# EAGLE design PMT_foot (EAGLE 5.11)
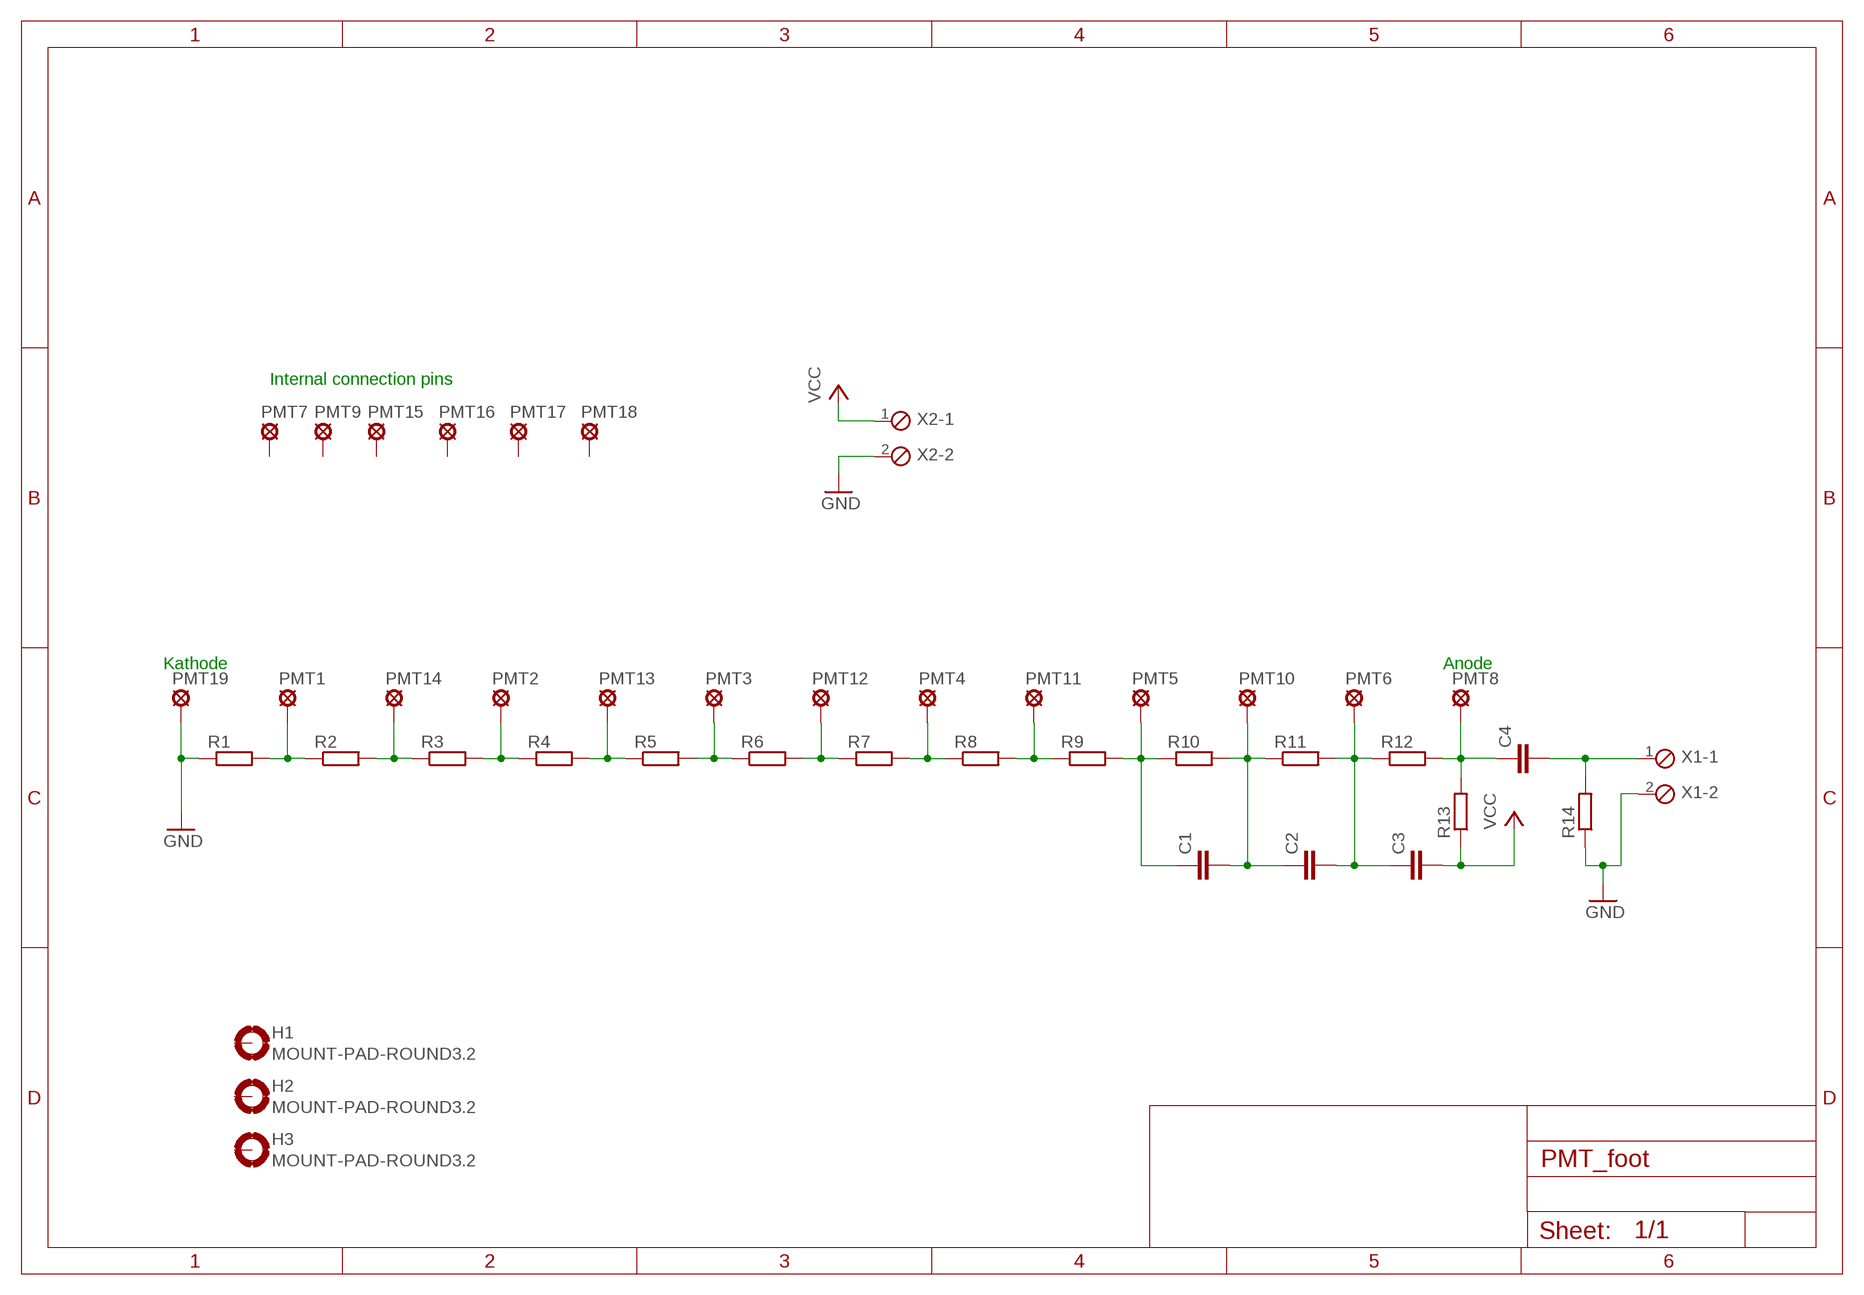
[diagram p0: schematic, sheet 1]

## Parts
C1  C15/7  [C15B7]
C2  C15/7  [C15B7]
C3  C15/7  [C15B7]
C4  C5/2.5  [C5B2.5]
H1  MOUNT-PAD-ROUND3.2  [3,2-PAD]
H2  MOUNT-PAD-ROUND3.2  [3,2-PAD]
H3  MOUNT-PAD-ROUND3.2  [3,2-PAD]
PMT1  SE14  [SE14]
PMT2  SE14  [SE14]
PMT3  SE14  [SE14]
PMT4  SE14  [SE14]
PMT5  SE14  [SE14]
PMT6  SE14  [SE14]
PMT7  SE14  [SE14]
PMT8  SE14  [SE14]
PMT9  SE14  [SE14]
PMT10  SE14  [SE14]
PMT11  SE14  [SE14]
PMT12  SE14  [SE14]
PMT13  SE14  [SE14]
PMT14  SE14  [SE14]
PMT15  SE14  [SE14]
PMT16  SE14  [SE14]
PMT17  SE14  [SE14]
PMT18  SE14  [SE14]
PMT19  SE14  [SE14]
R1  R-EU_0207/2V  [0207/2V]
R2  R-EU_0207/2V  [0207/2V]
R3  R-EU_0207/2V  [0207/2V]
R4  R-EU_0207/2V  [0207/2V]
R5  R-EU_0207/2V  [0207/2V]
R6  R-EU_0207/2V  [0207/2V]
R7  R-EU_0207/2V  [0207/2V]
R8  R-EU_0207/2V  [0207/2V]
R9  R-EU_0207/2V  [0207/2V]
R10  R-EU_0207/2V  [0207/2V]
R11  R-EU_0207/2V  [0207/2V]
R12  R-EU_0207/2V  [0207/2V]
R13  R-EU_0207/2V  [0207/2V]
R14  R-EU_0207/2V  [0207/2V]
X1  MPT2  [2POL254]
X2  MPT2  [2POL254]

## Nets
GND: PMT19.MP R1.1 R14.1 X1.2 X2.2
N$2: PMT1.MP R1.2 R2.1
N$3: PMT14.MP R2.2 R3.1
N$4: PMT2.MP R3.2 R4.1
N$5: PMT13.MP R4.2 R5.1
N$6: PMT3.MP R5.2 R6.1
N$7: PMT12.MP R6.2 R7.1
N$8: PMT4.MP R7.2 R8.1
N$9: PMT11.MP R8.2 R9.1
N$10: C1.1 PMT5.MP R9.2 R10.1
N$11: C1.2 C2.1 PMT10.MP R10.2 R11.1
N$12: C2.2 C3.1 PMT6.MP R11.2 R12.1
N$13: C4.1 PMT8.MP R12.2 R13.2
N$17: C4.2 R14.2 X1.1
VCC: C3.2 R13.1 X2.1
Unconnected: H1.B3,2(MOUNT) H2.B3,2(MOUNT) H3.B3,2(MOUNT) PMT7.MP PMT9.MP PMT15.MP PMT16.MP PMT17.MP PMT18.MP

## Notes on the sheet
- Internal connection pins
- Kathode | Anode

## Library data of the parts
C1-C4 = capacitor-wima:C: CAPACITOR naming: grid - package width
H1-H3 = holes:MOUNT-PAD-ROUND: MOUNTING PAD, round
PMT1-PMT19 = solpad:SE14: SOLDER PAD E1553, drill 1,4mm, distributor Buerklin, 07F820
R1-R14 = rcl:R-EU_: RESISTOR, European symbol
X1 X2 = con-phoenix-254:MPT2: PHOENIX CONNECTOR; OC_FARNELL: unknown; OC_NEWARK: unknown

## Board
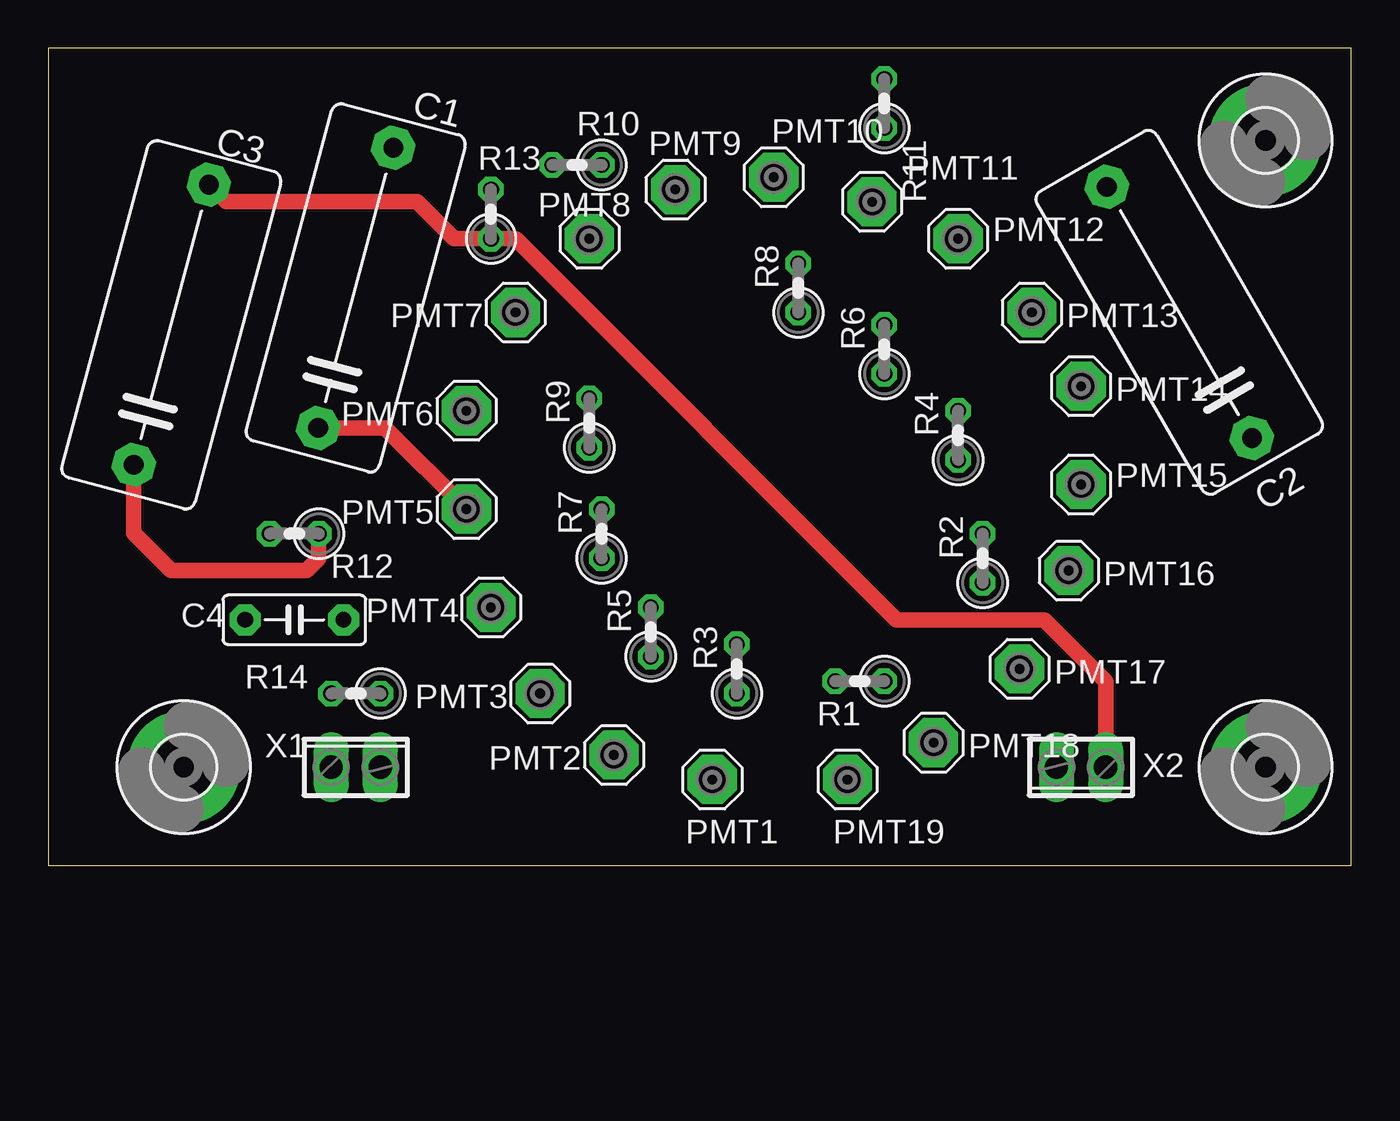
[diagram p1: board, top side]
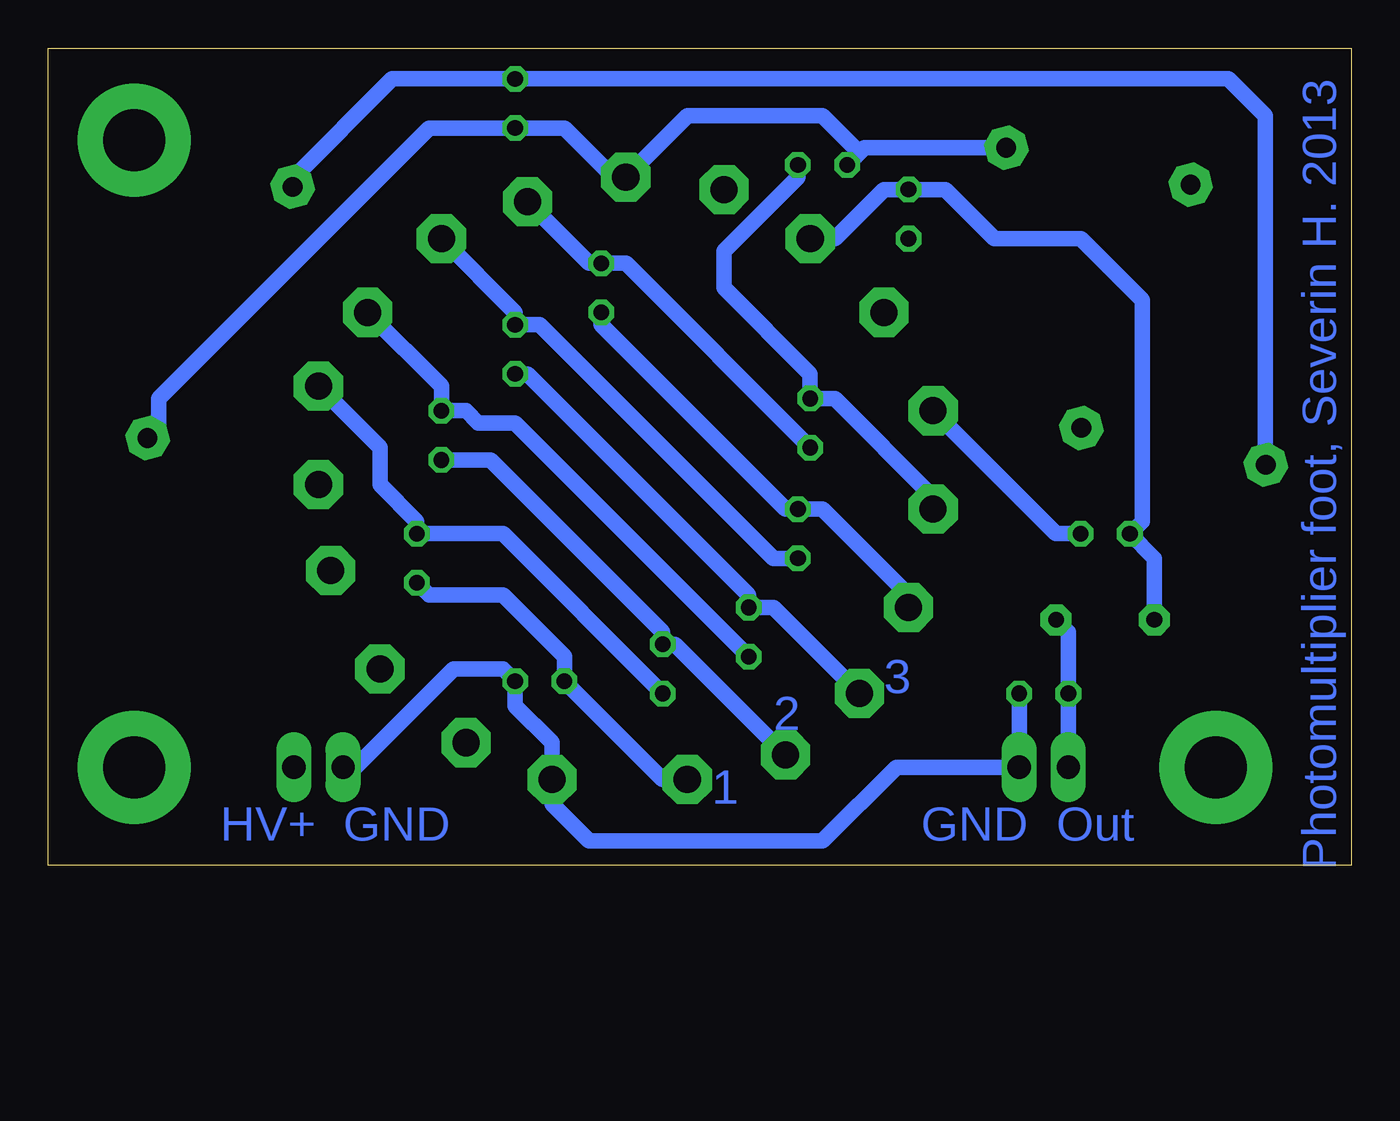
[diagram p2: board, bottom side, seen from below]

Size 67.29 x 42.22 mm. Coordinates in mm from the lower left corner, seen from the top.
Outline: 0,0 67.29,0 67.29,42.22 0,42.22 0,0
Copper layers (1*16): Top 0.035mm / dielectric 1.5mm / Bottom 0.035mm
Design rules "default": minimum track width 10mil, minimum drill 24mil, track to track 8mil, track to pad 8mil, pad to pad 8mil, via to via 8mil, smd to smd 8mil, copper to edge 40mil, drill to drill 8mil, minimum pad ring 10mil, minimum via ring 8mil, stop-mask expansion 4mil, vias tented up to drill 0mil, thermal gap 10mil

### Footprints (pad centres in the part's own frame; a part is rotated, then mirrored left to right if it is on the bottom)
C15B7 = drill 1.016 pad 2.159 octagon: 1 -7.493,0; 2 7.493,0
C5B2.5 = drill 0.813 pad 1.6 octagon: 1 -2.54,0; 2 2.54,0
3,2-PAD = drill 3.2 pad 5.842 round: B3,2 0,0
SE14 = drill 1.397 pad 2.54 octagon: MP 0,0
0207/2V = drill 0.813 octagon: 1 -1.27,0; 2 1.27,0
2POL254 = drill 1.2 long: 1 -1.27,0; 2 1.27,0

### Placement (x,y rotation side)
C1  15.88,29.84 75 top
C2  58.42,28.57 120 top
C3  6.35,27.94 75 top
C4  12.7,12.7 0 top
H1  6.99,5.08 0 top
H2  62.87,5.08 0 top
H3  62.87,37.47 0 top
PMT1  34.29,4.45 0 top
PMT2  29.21,5.71 0 top
PMT3  25.4,8.89 0 top
PMT4  22.86,13.34 0 top
PMT5  21.59,18.41 0 top
PMT6  21.59,23.5 0 top
PMT7  24.13,28.57 0 top
PMT8  27.94,32.38 0 top
PMT9  32.38,34.92 0 top
PMT10  37.47,35.56 0 top
PMT11  42.55,34.29 0 top
PMT12  46.99,32.38 0 top
PMT13  50.8,28.57 0 top
PMT14  53.34,24.77 0 top
PMT15  53.34,19.68 0 top
PMT16  52.7,15.24 0 top
PMT17  50.16,10.16 0 top
PMT18  45.72,6.35 0 top
PMT19  41.27,4.45 0 top
R1  41.91,9.53 180 top
R2  48.26,15.88 90 top
R3  35.56,10.16 90 top
R4  46.99,22.23 90 top
R5  31.11,12.06 90 top
R6  43.18,26.67 90 top
R7  28.57,17.14 90 top
R8  38.73,29.84 90 top
R9  27.94,22.86 90 top
R10  27.3,36.2 180 top
R11  43.18,39.37 90 top
R12  12.7,17.14 180 top
R13  22.86,33.66 90 top
R14  15.88,8.89 180 top
X1  15.88,5.08 0 top
X2  53.34,5.08 180 top

### Tracks (layer width: path | path; a pad name or v marks a point on that pad's centre or on a via)
GND
  Bottom 0.813: R14.1 X1.2 23.5,5.08 27.3,1.27 39.37,1.27 41.27,3.17 PMT19.MP 41.27,6.35 43.18,8.26 R1.1 43.81,10.16 46.35,10.16 51.44,5.08 X2.2
N$2
  Bottom 0.813: PMT1.MP 35.56,4.45 R1.2 40.64,10.79 43.81,13.97 47.62,13.97 R2.1
N$3
  Bottom 0.813: PMT14.MP 50.16,21.59 50.16,19.68 48.26,17.78 R2.2 43.81,17.14 R3.1
N$4
  Bottom 0.813: R4.1 44.45,20.95 35.56,12.06 R3.2 34.92,11.43 PMT2.MP
N$5
  Bottom 0.813: PMT13.MP 46.99,24.77 R4.2 45.72,23.5 45.09,22.86 43.18,22.86 R5.1
N$6
  Bottom 0.813: R6.1 42.55,25.4 31.11,13.97 R5.2 29.84,13.34 PMT3.MP
N$7
  Bottom 0.813: PMT12.MP 43.18,28.57 R6.2 41.91,27.94 29.84,15.88 R7.1
N$8
  Bottom 0.813: R8.1 38.73,27.94 29.21,18.41 R7.2 27.3,18.41 22.86,13.97 PMT4.MP
N$9
  Bottom 0.813: PMT11.MP 39.37,31.11 R8.2 37.47,31.11 R9.1
N$10
  Top 0.813: C1.1 17.4,22.61 PMT5.MP
  Bottom 0.813: PMT5.MP 21.59,19.05 26.67,24.13 R9.2 27.94,25.4 32.38,29.84 32.38,31.75 28.57,35.56 R10.1
N$11
  Bottom 0.813: C1.2 25.15,37.08 25.4,36.83 | 25.4,36.83 R10.2 | 25.4,36.83 27.3,38.73 34.29,38.73 PMT10.MP 38.1,35.56 40.64,38.1 R11.1 47.62,38.1 61.59,24.13 61.59,22.66 C2.1
N$12
  Top 0.813: C3.1 4.41,17.18 6.35,15.24 13.34,15.24 13.97,15.88 R12.1
  Bottom 0.813: C2.2 54.67,35.5 49.53,40.64 R11.2 6.35,40.64 4.45,38.73 4.45,20.74 C3.1 | R12.1 15.24,17.14 PMT6.MP
N$13
  Bottom 0.813: PMT8.MP 26.67,32.38 24.13,34.92 R13.2 20.95,34.92 18.41,32.38 13.97,32.38 10.79,29.21 10.79,17.78 R12.2 10.16,15.88 C4.1
N$17
  Bottom 0.813: X1.1 R14.2 14.61,12.06 C4.2
VCC
  Top 0.813: C3.2 9.18,34.29 19.05,34.29 20.95,32.38 R13.1 24.13,32.38 43.81,12.7 51.44,12.7 54.61,9.53 X2.1

### Text on the board
Bottom: Photomultiplier foot, Severin H. 2013 | 3 | 2 | 1 | Out | GND | GND | HV+